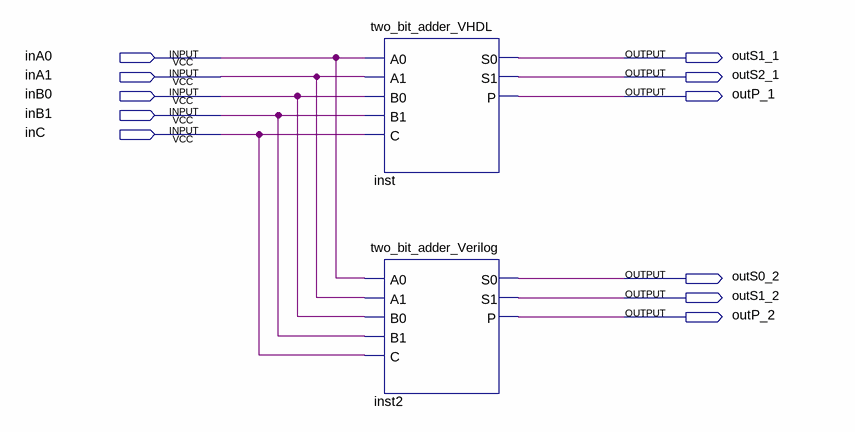
[diagram p0: schematic sheet]
// Quartus schematic lab7_adder.bdf as structural Verilog: 2 symbols, 11 pins
module lab7_adder (
  input  inA0,
  input  inA1,
  input  inB0,
  input  inB1,
  input  inC,
  output outS1_1,
  output outS2_1,
  output outP_1,
  output outS0_2,
  output outS1_2,
  output outP_2
);

  two_bit_adder_VHDL inst (.A0(inA0), .A1(inA1), .B0(inB0), .B1(inB1), .C(inC), .S0(outS1_1), .S1(outS2_1), .P(outP_1));
  two_bit_adder_Verilog inst2 (
    .A0(inA0), .A1(inA1), .B0(inB0), .B1(inB1), .C(inC), .S0(outS0_2), .S1(outS1_2), .P(outP_2));
endmodule
